# Altium schematic sheet SVPXFMC_Carrier_6U.SchDoc: Title
size 420 x 297 mm; CheckedBy: G.Kasprowicz; Author: G.Kasprowicz; CompanyName: WUT ISE; DrawnBy: F.Switakowski; Organization: WUT ISE; Address1: PW ISE; Address2: Nowowiejska 15/19 00-665 Warsaw; Revision: -; SheetNumber: -; SheetTotal: -; ModifiedBy: -; CheckedDate: -; Title2: Title2; DivGrp: WUT ISE; Designer: G.Kasprowicz; ModifiedDate: -; ProjectName: FMC SFP 4
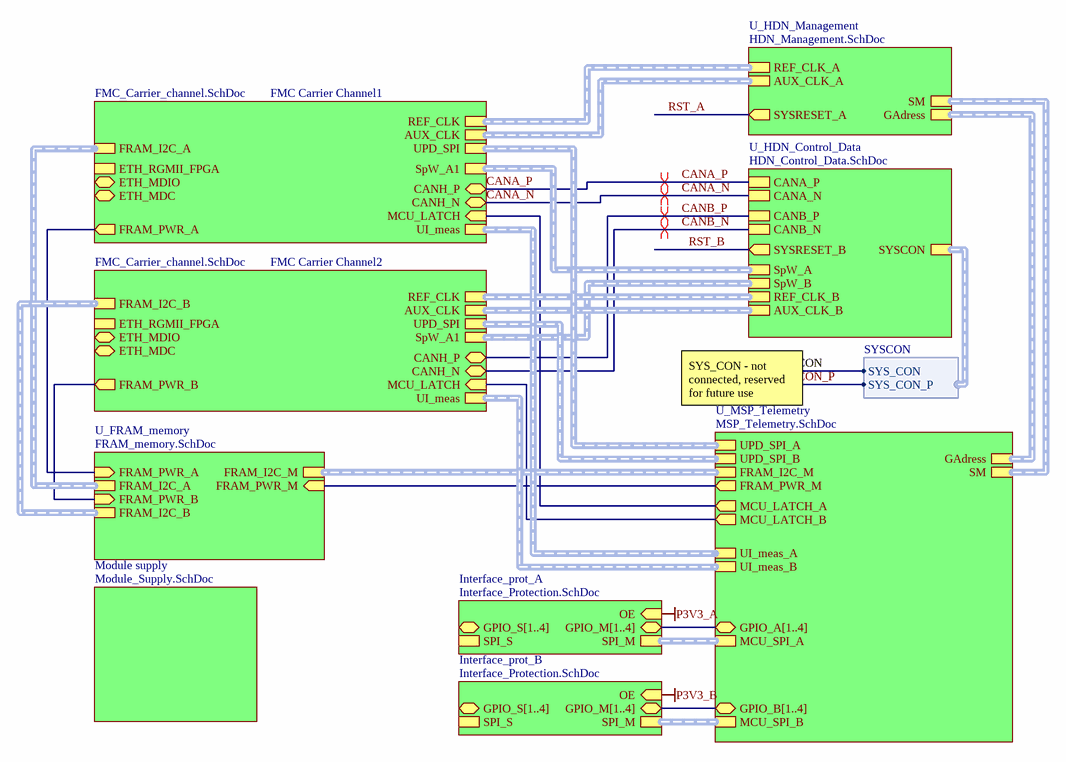
[diagram p0: SVPXFMC_Carrier_6U.SchDoc]

## Sub-sheets
FMC Carrier Channel1 = FMC_Carrier_channel.SchDoc: ETH_RGMII_FPGA (harness RGMII), ETH_MDIO (bidir), ETH_MDC (bidir), UI_meas, SpW_A1 (harness SpW), CANH_N (bidir), CANH_P (bidir), UPD_SPI, REF_CLK (harness CLK), AUX_CLK (harness CLK), FRAM_PWR_A (out), FRAM_I2C_A, MCU_LATCH (in)
FMC Carrier Channel2 = FMC_Carrier_channel.SchDoc: ETH_RGMII_FPGA (harness RGMII), ETH_MDIO (bidir), ETH_MDC (bidir), UI_meas, SpW_A1 (harness SpW), CANH_N (bidir), CANH_P (bidir), UPD_SPI, REF_CLK (harness CLK), AUX_CLK (harness CLK), FRAM_PWR_B (out), FRAM_I2C_B, MCU_LATCH (in)
Interface_prot_A = Interface_Protection.SchDoc: SPI_M (harness SPI), SPI_S (harness SPI), OE (in), GPIO_S[1..4] (bidir), GPIO_M[1..4] (bidir)
Interface_prot_B = Interface_Protection.SchDoc: SPI_M (harness SPI), SPI_S (harness SPI), OE (in), GPIO_S[1..4] (bidir), GPIO_M[1..4] (bidir)
Module supply = Module_Supply.SchDoc: no entries
U_FRAM_memory = FRAM_memory.SchDoc: FRAM_I2C_B (harness I2C), FRAM_I2C_M (harness I2C), FRAM_I2C_A (harness I2C), FRAM_PWR_A (in), FRAM_PWR_B (in), FRAM_PWR_M (in)
U_HDN_Control_Data = HDN_Control_Data.SchDoc: AUX_CLK_B (harness CLK), REF_CLK_B (harness CLK), SYSCON (harness SYSCON), SpW_A (harness SpW), SpW_B (harness SpW), SYSRESET_B (out), CANA_P, CANA_N, CANB_P, CANB_N
U_HDN_Management = HDN_Management.SchDoc: AUX_CLK_A (harness CLK), REF_CLK_A (harness CLK), GAdress (harness GAdress), SM (harness SM), SYSRESET_A (out)
U_MSP_Telemetry = MSP_Telemetry.SchDoc: FRAM_I2C_M (harness I2C), MCU_SPI_A (harness SPI), MCU_SPI_B (harness SPI), MCU_LATCH_B (out), MCU_LATCH_A (out), SM (harness SM), GAdress (harness GAdress), GPIO_A[1..4] (bidir), GPIO_B[1..4] (bidir), FRAM_PWR_M (out), UPD_SPI_A, UPD_SPI_B, UI_meas_A, UI_meas_B

## Harnesses
SYSCON: SYS_CON, SYS_CON_P

## Nets
P3V3_A: sheet Interface_prot_A/OE
P3V3_B: sheet Interface_prot_B/OE
CANA_N: sheet FMC Carrier Channel1/CANH_N, sheet U_HDN_Control_Data/CANA_N
CANA_P: sheet FMC Carrier Channel1/CANH_P, sheet U_HDN_Control_Data/CANA_P
CANB_N: sheet FMC Carrier Channel2/CANH_N, sheet U_HDN_Control_Data/CANB_N
CANB_P: sheet FMC Carrier Channel2/CANH_P, sheet U_HDN_Control_Data/CANB_P
RST_A: sheet U_HDN_Management/SYSRESET_A
RST_B: sheet U_HDN_Control_Data/SYSRESET_B
SYS_CON: sheet U_HDN_Control_Data/SYSCON.SYS_CON
SYS_CON_P: sheet U_HDN_Control_Data/SYSCON.SYS_CON_P
(unnamed): sheet FMC Carrier Channel1/FRAM_PWR_A, sheet U_FRAM_memory/FRAM_PWR_A
(unnamed): sheet FMC Carrier Channel1/MCU_LATCH, sheet U_MSP_Telemetry/MCU_LATCH_A
(unnamed): sheet FMC Carrier Channel2/FRAM_PWR_B, sheet U_FRAM_memory/FRAM_PWR_B
(unnamed): sheet FMC Carrier Channel2/MCU_LATCH, sheet U_MSP_Telemetry/MCU_LATCH_B
(unnamed): sheet U_MSP_Telemetry/FRAM_PWR_M, sheet U_FRAM_memory/FRAM_PWR_M

## Buses and harness runs
bus sheet Interface_prot_A/GPIO_M[1..4] = sheet U_MSP_Telemetry/GPIO_A[1..4]
bus sheet Interface_prot_B/GPIO_M[1..4] = sheet U_MSP_Telemetry/GPIO_B[1..4]
harness sheet FMC Carrier Channel1/AUX_CLK = sheet U_HDN_Management/AUX_CLK_A
harness sheet FMC Carrier Channel1/FRAM_I2C_A = sheet U_FRAM_memory/FRAM_I2C_A
harness sheet FMC Carrier Channel1/REF_CLK = sheet U_HDN_Management/REF_CLK_A
harness sheet FMC Carrier Channel1/SpW_A1 = sheet U_HDN_Control_Data/SpW_A
harness sheet FMC Carrier Channel1/UI_meas = sheet U_MSP_Telemetry/UI_meas_A
harness sheet FMC Carrier Channel1/UPD_SPI = sheet U_MSP_Telemetry/UPD_SPI_A
harness sheet FMC Carrier Channel2/AUX_CLK = sheet U_HDN_Control_Data/AUX_CLK_B
harness sheet FMC Carrier Channel2/FRAM_I2C_B = sheet U_FRAM_memory/FRAM_I2C_B
harness sheet FMC Carrier Channel2/REF_CLK = sheet U_HDN_Control_Data/REF_CLK_B
harness sheet FMC Carrier Channel2/SpW_A1 = sheet U_HDN_Control_Data/SpW_B
harness sheet FMC Carrier Channel2/UI_meas = sheet U_MSP_Telemetry/UI_meas_B
harness sheet FMC Carrier Channel2/UPD_SPI = sheet U_MSP_Telemetry/UPD_SPI_B
harness sheet Interface_prot_A/SPI_M = sheet U_MSP_Telemetry/MCU_SPI_A
harness sheet Interface_prot_B/SPI_M = sheet U_MSP_Telemetry/MCU_SPI_B
harness sheet U_FRAM_memory/FRAM_I2C_M = sheet U_MSP_Telemetry/FRAM_I2C_M
harness sheet U_HDN_Management/GAdress = sheet U_MSP_Telemetry/GAdress
harness sheet U_HDN_Management/SM = sheet U_MSP_Telemetry/SM

## Layout directives
differential pair: CANA_N, CANA_P, CANB_N, CANB_P

## Notes on the sheet
- SYS_CON - not connected, reserved  for future use
- Project/Equipment
- Document
- Designer
- Drawn by
- Check.by
- Copyright WUT ISE 2018.
  This documentation describes Open Hardware and is licensed under the CERN OHL v.1.1. You may redistribute and modify this documentation under the terms of the CERN OHL v.1.1. (http://ohwr.org/CERNOHL). This documentation is distributed WITHOUT ANY EXPRESS OR IMPLIED WARRANTY, INCLUDING OF MERCHANTABILITY, SATISFACTORY QUALITY AND FITNESS FOR A PARTICULAR PURPOSE. Please see the CERN OHL v.1.1 for applicable conditions.
- File
- Last Mod.
- Print Date
- Sheet
- Size
- A3
- of
- Rev